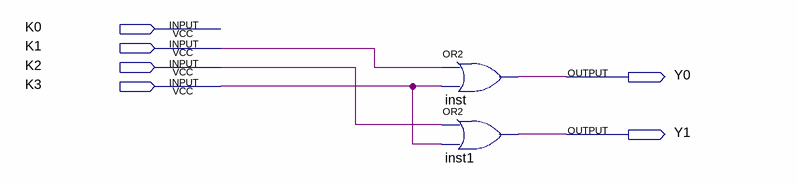
[diagram p0: schematic sheet]
// Quartus schematic 4x2_Prioity_Encoder.bdf as structural Verilog: 2 symbols, 6 pins
module \4x2_Prioity_Encoder  (
  input  K0,
  input  K1,
  input  K2,
  input  K3,
  output Y0,
  output Y1
);

  or inst (Y0, K1, K3);
  or inst1 (Y1, K2, K3);
endmodule
